# EAGLE design taptdoa_1.x (EAGLE 9.2.2)
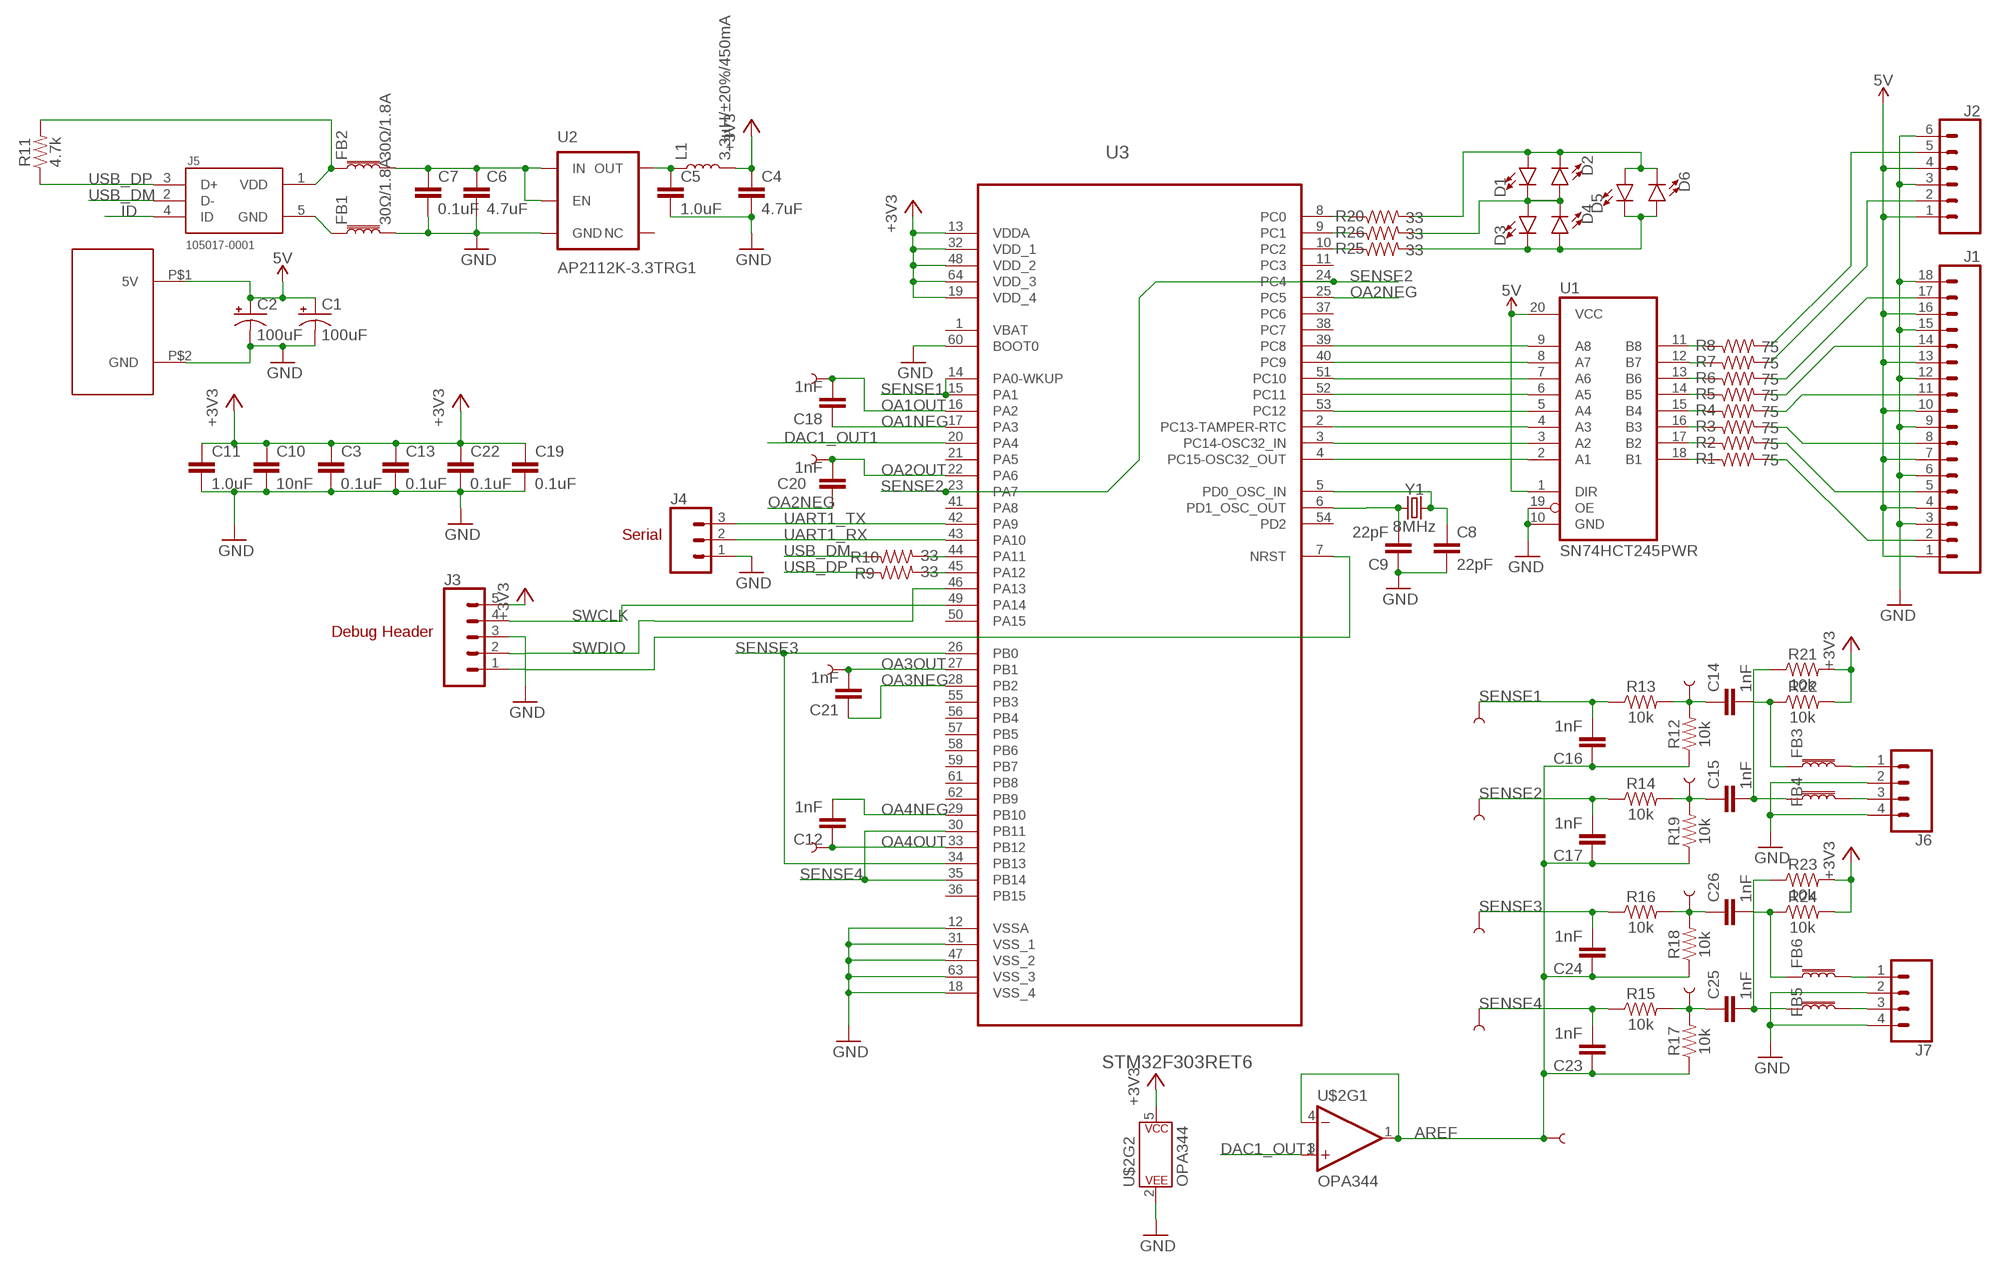
[diagram p0: schematic, sheet 1]

## Parts
C1  100uF  100UF-POLAR-25V-20%(ELEC)  [PANASONIC_D]
C2  100uF  100UF-POLAR-25V-20%(ELEC)  [PANASONIC_D]
C3  0.1uF  0.1UF-0603-25V-5%  [0603]
C4  4.7uF  4.7UF0603  [0603]
C5  1.0uF  1.0UF-0603-16V-10%  [0603]
C6  4.7uF  1.0UF-0603-16V-10%  [0603]
C7  0.1uF  0.1UF-0603-25V-5%  [0603]
C8  22pF  22PF-0603-50V-5%  [0603]
C9  22pF  22PF-0603-50V-5%  [0603]
C10  10nF  10NF-0603-50V-10%  [0603]
C11  1.0uF  1.0UF-0603-16V-10%  [0603]
C12  1nF  1.0UF-0603-16V-10%  [0603]
C13  0.1uF  0.1UF-0603-25V-5%  [0603]
C14  1nF  1.0UF-0603-16V-10%  [0603]
C15  1nF  1.0UF-0603-16V-10%  [0603]
C16  1nF  1.0UF-0603-16V-10%  [0603]
C17  1nF  1.0UF-0603-16V-10%  [0603]
C18  1nF  1.0UF-0603-16V-10%  [0603]
C19  0.1uF  0.1UF-0603-25V-5%  [0603]
C20  1nF  1.0UF-0603-16V-10%  [0603]
C21  1nF  1.0UF-0603-16V-10%  [0603]
C22  0.1uF  0.1UF-0603-25V-5%  [0603]
C23  1nF  1.0UF-0603-16V-10%  [0603]
C24  1nF  1.0UF-0603-16V-10%  [0603]
C25  1nF  1.0UF-0603-16V-10%  [0603]
C26  1nF  1.0UF-0603-16V-10%  [0603]
D1  LED0603  [LED-0603]
D2  LED0603  [LED-0603]
D3  LED0603  [LED-0603]
D4  LED0603  [LED-0603]
D5  LED0603  [LED-0603]
D6  LED0603  [LED-0603]
FB1  30Ω/1.8A  FERRITE_BEAD-0603  [0603]
FB2  30Ω/1.8A  FERRITE_BEAD-0603  [0603]
FB3  30Ω/1.8A  FERRITE_BEAD-0603  [0603]
FB4  30Ω/1.8A  FERRITE_BEAD-0603  [0603]
FB5  30Ω/1.8A  FERRITE_BEAD-0603  [0603]
FB6  30Ω/1.8A  FERRITE_BEAD-0603  [0603]
J1  CONN_18  [1X18]
J2  CONN_06LOCK  [1X06_LOCK]
J3  CONN_05LOCK  [1X05_LOCK]
J4  CONN_03  [1X03]
J5  105017-0001  [MOLEX_105017-0001]
J6  CONN_04LOCK_LONGPADS  [1X04_LOCK_LONGPADS]
J7  CONN_04LOCK_LONGPADS  [1X04_LOCK_LONGPADS]
L1  3.3µH/±20%/450mA  INDUCTOR-0805-3.3UH  [0805]
R1  75  100OHM-0603-1/4W-5%  [0603]
R2  75  100OHM-0603-1/4W-5%  [0603]
R3  75  100OHM-0603-1/4W-5%  [0603]
R4  75  100OHM-0603-1/4W-5%  [0603]
R5  75  100OHM-0603-1/4W-5%  [0603]
R6  75  100OHM-0603-1/4W-5%  [0603]
R7  75  100OHM-0603-1/4W-5%  [0603]
R8  75  100OHM-0603-1/4W-5%  [0603]
R9  33  100OHM-0603-1/4W-5%  [0603]
R10  33  100OHM-0603-1/4W-5%  [0603]
R11  4.7k  RESISTOR0603  [0603]
R12  10k  RESISTOR0603  [0603]
R13  10k  RESISTOR0603  [0603]
R14  10k  RESISTOR0603  [0603]
R15  10k  RESISTOR0603  [0603]
R16  10k  RESISTOR0603  [0603]
R17  10k  RESISTOR0603  [0603]
R18  10k  RESISTOR0603  [0603]
R19  10k  RESISTOR0603  [0603]
R20  33  100OHM-0603-1/4W-5%  [0603]
R21  10k  RESISTOR0603  [0603]
R22  10k  RESISTOR0603  [0603]
R23  10k  RESISTOR0603  [0603]
R24  10k  RESISTOR0603  [0603]
R25  33  100OHM-0603-1/4W-5%  [0603]
R26  33  100OHM-0603-1/4W-5%  [0603]
TP1  TEST-POINT3X4  [PAD.03X.04]
TP2  TEST-POINT3X4  [PAD.03X.04]
TP3  TEST-POINT3X4  [PAD.03X.04]
TP4  TEST-POINT3X4  [PAD.03X.04]
TP5  TEST-POINT3X4  [PAD.03X.04]
TP6  TEST-POINT3X4  [PAD.03X.04]
TP7  TEST-POINT3X4  [PAD.03X.04]
TP8  TEST-POINT3X4  [PAD.03X.04]
TP9  TEST-POINT3X4  [PAD.03X.04]
TP10  TEST-POINT3X4  [PAD.03X.04]
TP11  TEST-POINT3X4  [PAD.03X.04]
TP12  TEST-POINT3X4  [PAD.03X.04]
TP13  TEST-POINT3X4  [PAD.03X.04]
U1  SN74HCT245PWR  74245PW  [TSSOP20]
U2  AP2112K-3.3TRG1  V_REG_AP2112K-3.3V  [SOT23-5]
U3  STM32F303RET6  STM32F103RBT6  [QFP50P1200X1200X160-64N]
U$1  XT30XT30_THRUHOLE  [ZT30]
U$2  OPA344  [SOT23-5]
Y1  8MHz  CRYSTALSMD-HC49UP  [HC49UP]

## Nets
5V: C1.+ C2.+ J1.1 J1.4 J1.7 J1.10 J1.13 J1.16 J2.1 J2.4 U1.1(DIR) U1.20(VCC) U$1.P$1(5V)
+3V3: C3.1 C4.1 C10.1 C11.1 C13.1 C19.1 C22.1 J3.5 L1.2 R21.2 R22.2 R23.2 R24.2 U3.13(VDDA) U3.19(VDD_4) U3.32(VDD_1) U3.48(VDD_2) U3.64(VDD_3) U$2.5(P$V+)
AREF: C16.1 C17.1 C23.1 C24.1 R12.1 R17.1 R18.1 R19.1 TP8.P$1 U$2.1(OUT) U$2.4(-IN)
DAC1_OUT1: U3.20(PA4) U$2.3(+IN)
GND: C1.- C2.- C3.2 C4.2 C5.2 C6.2 C7.2 C8.2 C9.1 C10.2 C11.2 C13.2 C19.2 C22.2 FB1.2 J1.3 J1.6 J1.9 J1.12 J1.15 J1.18 J2.3 J2.6 J3.3 J4.1 J6.2 J6.4 J7.2 J7.4 U1.10(GND) U1.19(OE) U2.2(GND) U3.12(VSSA) U3.18(VSS_4) U3.31(VSS_1) U3.47(VSS_2) U3.60(BOOT0) U3.63(VSS_3) U$1.P$2(GND) U$2.2(P$V-)
HP1: C14.1 R12.2 R13.2 TP2.P$1
HP2: C15.1 R14.2 R19.2 TP3.P$1
HP3: C26.1 R16.2 R18.2 TP12.P$1
HP4: C25.1 R15.2 R17.2 TP13.P$1
ID: J5.4(ID)
LED0: J1.2 R1.2
LED1: J1.5 R2.2
LED2: J1.8 R3.2
LED3: J1.11 R4.2
LED4: J1.14 R5.2
LED5: J1.17 R6.2
N$1: R20.1 U3.8(PC0)
N$2: D1.A D2.C D5.A D6.C R20.2
N$4: R25.1 U3.10(PC2)
N$5: R26.1 U3.9(PC1)
N$6: D1.C D2.A D3.A D4.C R26.2
N$9: R10.1 U3.44(PA11)
N$10: R9.1 U3.45(PA12)
N$11: FB1.1 J5.5(GND)
N$12: C5.1 L1.1 U2.5(OUT)
N$13: R1.1 U1.18(B1)
N$14: R2.1 U1.17(B2)
N$15: R3.1 U1.16(B3)
N$16: R4.1 U1.15(B4)
N$17: R5.1 U1.14(B5)
N$18: R6.1 U1.13(B6)
N$19: C14.2 FB3.1 R22.1
N$20: C26.2 FB6.1 R24.1
N$21: C15.2 FB4.1 R21.1
N$22: D3.C D4.A D5.C D6.A R25.2
N$23: C25.2 FB5.1 R23.1
N$27: R7.1 U1.12(B7)
N$28: R8.1 U1.11(B8)
N$29: J2.2 R7.2
N$30: J2.5 R8.2
N$31: FB3.2 J6.1
N$32: FB6.2 J7.1
N$33: FB5.2 J7.3
N$34: FB4.2 J6.3
NRST: J3.1 U3.7(NRST)
OA1NEG: C18.1 U3.17(PA3)
OA1OUT: C18.2 TP6.P$1 U3.16(PA2)
OA2NEG: C20.1 U3.25(PC5)
OA2OUT: C20.2 TP7.P$1 U3.22(PA6)
OA3NEG: C21.1 U3.28(PB2)
OA3OUT: C21.2 TP9.P$1 U3.27(PB1)
OA4NEG: C12.2 U3.29(PB10)
OA4OUT: C12.1 TP1.P$1 U3.33(PB12)
PA13: J3.2 U3.46(PA13)
PA14: J3.4 U3.49(PA14)
PC8: U1.9(A8) U3.39(PC8)
PC9: U1.8(A7) U3.40(PC9)
PC10: U1.7(A6) U3.51(PC10)
PC11: U1.6(A5) U3.52(PC11)
PC12: U1.5(A4) U3.53(PC12)
PC13: U1.4(A3) U3.2(PC13-TAMPER-RTC)
PC14: U1.3(A2) U3.3(PC14-OSC32_IN)
PC15: U1.2(A1) U3.4(PC15-OSC32_OUT)
PD0_OSC_IN: C8.1 U3.5(PD0_OSC_IN) Y1.2
PD1_OSC_OUT: C9.2 U3.6(PD1_OSC_OUT) Y1.1
SENSE1: C16.2 R13.1 TP4.P$1 U3.14(PA0-WKUP) U3.15(PA1)
SENSE2: C17.2 R14.1 TP5.P$1 U3.23(PA7) U3.24(PC4)
SENSE3: C24.2 R16.1 TP10.P$1 U3.26(PB0) U3.34(PB13)
SENSE4: C23.2 R15.1 TP11.P$1 U3.30(PB11) U3.35(PB14)
UART1_RX: J4.2 U3.43(PA10)
UART1_TX: J4.3 U3.42(PA9)
USB_DM: J5.2(D-) R10.2
USB_DP: J5.3(D+) R9.2 R11.1
VUSB: FB2.1 J5.1(VDD) R11.2
VUSB2: C6.1 C7.1 FB2.2 U2.1(IN) U2.3(EN)
Unconnected: U2.4(NC) U3.1(VBAT) U3.11(PC3) U3.21(PA5) U3.36(PB15) U3.37(PC6) U3.38(PC7) U3.41(PA8) U3.50(PA15) U3.54(PD2) U3.55(PB3) U3.56(PB4) U3.57(PB5) U3.58(PB6) U3.59(PB7) U3.61(PB8) U3.62(PB9)

## Notes on the sheet
- Serial
- SWCLK
- Debug Header
- SWDIO

## Library data of the parts
C1 C2 = SparkFun-Capacitors:100UF-POLAR: 100µF polarized capacitors A capacitor is a passive two-terminal electrical component used to store electrical energy temporarily in an electric field.; PROD_ID: CAP-12547
C3 C7 C13 C19 C22 = SparkFun-Capacitors:0.1UF: 0.1µF ceramic capacitors A capacitor is a passive two-terminal electrical component used to store electrical energy temporarily in an electric field.; PROD_ID: CAP-08604
C4 = SparkFun-Capacitors:4.7UF: 4.7µF ceramic capacitors A capacitor is a passive two-terminal electrical component used to store electrical energy temporarily in an electric field.; PROD_ID: CAP-08280
C5 C11 = SparkFun-Capacitors:1.0UF: 1µF ceramic capacitors A capacitor is a passive two-terminal electrical component used to store electrical energy temporarily in an electric field.; PROD_ID: CAP-00868
C6 C12 C14-C18 C20 C21 C23-C26 = SparkFun-Capacitors:1.0UF: 1µF ceramic capacitors A capacitor is a passive two-terminal electrical component used to store electrical energy temporarily in an electric field.; PROD_ID: CAP-00868; VALUE: 1.0uF
C8 C9 = SparkFun-Capacitors:22PF: 22pF ceramic capacitors A capacitor is a passive two-terminal electrical component used to store electrical energy temporarily in an electric field.; PROD_ID: CAP-07876
C10 = SparkFun-Capacitors:10NF: 0.01uF/10nF/10,000pF ceramic capacitors A capacitor is a passive two-terminal electrical component used to store electrical energy temporarily in an electric field. CAP-09321; PROD_ID: CAP-00867
D1-D6 = SparkFun-LED:LED: LED (Generic) Standard schematic elements and footprints for 5mm, 3mm, 1206, and 0603 sized LEDs. Generic LEDs with no color specified.
FB1-FB6 = SparkFun-Coils:FERRITE_BEAD: Ferrite Bead (blocks, cores, rings, chokes, etc.) Inductor with layers of ferrite used to suppress high frequencies. Often used to isolate high frequency noise. SparkFun Products: IOIO-OTG - V2.2 <https://www.sparkfun.com/products/13613> SparkFun SAMD21 Mini Breakout <https://www.sparkfun.com/products/13664> SparkFun 6 Degrees of Freedom Breakout - LSM6DS3 <https://www.sparkfun.com/products/13339> SparkFun SAMD21 Dev Breakout <https://www.sparkfun.com/products/13672>; PROD_ID: NDUC-07859
J1 = SparkFun-Connectors:CONN_18: Multi connection point. Often used as Generic Header-pin footprint for 0.1 inch spaced/style header connections On any of the 0.1 inch spaced packages, you can populate with these: Break Away Headers - Straight <https://www.sparkfun.com/products/116> (PRT-00116) Break Away Male Headers - Right Angle <https://www.sparkfun.com/products/553> (PRT-00553) Female Headers <https://www.sparkfun.com/products/115> (PRT-00115) Break Away Headers - Machine Pin <https://www.sparkfun.com/products/117> (PRT-00117) Break Away Female Headers - Swiss Machine Pin <https://www.sparkfun.com/products/743> (PRT-00743) For SCREWTERMINALS and SPRING TERMINALS visit here: Screw Terimnals on SparkFun.com <https://www.sparkfun.com/search/results?term=Screw+Terminals> (5mm/3.5mm/2.54mm spacing) This device is also useful as a general connection point to wire up your design to another part of your project. Our various solder wires solder well into these plated through hole pads. Hook-Up Wire - Assortment (Stranded, 22 AWG) <https://www.sparkfun.com/products/11375> (PRT-11375) Hook-Up Wire - Assortment (Solid Core, 22 AWG) <https://www.sparkfun.com/products/11367> (PRT-11367) View the entire wire category on our website here <https://www.sparkfun.com/categories/141> Special notes: Molex polarized connector foot print use with SKU : PRT-08231 with associated crimp pins and housings. 1MM SMD Version SKU: PRT-10208 NOTES ON THE VARIANTS LOCK and LOCK_LONGPADS... This footprint was designed to help hold the alignment of a through-hole component (i.e. 6-pin header) while soldering it into place. You may notice that each hole has been shifted either up or down by 0.005 of an inch from it's more standard position (which is a perfectly straight line). This slight alteration caused the pins (the squares in the middle) to touch the edges of the holes. Because they are alternating, it causes a "brace" to hold the component in place. 0.005 has proven to be the perfect amount of "off-center" position when using our standard breakaway headers. Although looks a little odd when you look at the bare footprint, once you have a header in there, the alteration is very hard to notice. Also,if you push a header all the way into place, it is covered up entirely on the bottom side.
J2 = SparkFun-Connectors:CONN_06: Multi connection point. Often used as Generic Header-pin footprint for 0.1 inch spaced/style header connections On any of the 0.1 inch spaced packages, you can populate with these: Break Away Headers - Straight <https://www.sparkfun.com/products/116> (PRT-00116) Break Away Male Headers - Right Angle <https://www.sparkfun.com/products/553> (PRT-00553) Female Headers <https://www.sparkfun.com/products/115> (PRT-00115) Break Away Headers - Machine Pin <https://www.sparkfun.com/products/117> (PRT-00117) Break Away Female Headers - Swiss Machine Pin <https://www.sparkfun.com/products/743> (PRT-00743) Arduino Stackable Header - 6 Pin <https://www.sparkfun.com/products/9280> (PRT-09280) For SCREWTERMINALS and SPRING TERMINALS visit here: Screw Terimnals on SparkFun.com <https://www.sparkfun.com/search/results?term=Screw+Terminals> (5mm/3.5mm/2.54mm spacing) This device is also useful as a general connection point to wire up your design to another part of your project. Our various solder wires solder well into these plated through hole pads. Hook-Up Wire - Assortment (Stranded, 22 AWG) <https://www.sparkfun.com/products/11375> (PRT-11375) Hook-Up Wire - Assortment (Solid Core, 22 AWG) <https://www.sparkfun.com/products/11367> (PRT-11367) View the entire wire category on our website here <https://www.sparkfun.com/categories/141>
J3 = SparkFun-Connectors:CONN_05: Multi connection point. Often used as Generic Header-pin footprint for 0.1 inch spaced/style header connections On any of the 0.1 inch spaced packages, you can populate with these: Break Away Headers - Straight <https://www.sparkfun.com/products/116> (PRT-00116) Break Away Male Headers - Right Angle <https://www.sparkfun.com/products/553> (PRT-00553) Female Headers <https://www.sparkfun.com/products/115> (PRT-00115) Break Away Headers - Machine Pin <https://www.sparkfun.com/products/117> (PRT-00117) Break Away Female Headers - Swiss Machine Pin <https://www.sparkfun.com/products/743> (PRT-00743) For SCREWTERMINALS and SPRING TERMINALS visit here: Screw Terimnals on SparkFun.com <https://www.sparkfun.com/search/results?term=Screw+Terminals> (5mm/3.5mm/2.54mm spacing) This device is also useful as a general connection point to wire up your design to another part of your project. Our various solder wires solder well into these plated through hole pads. Hook-Up Wire - Assortment (Stranded, 22 AWG) <https://www.sparkfun.com/products/11375> (PRT-11375) Hook-Up Wire - Assortment (Solid Core, 22 AWG) <https://www.sparkfun.com/products/11367> (PRT-11367) View the entire wire category on our website here <https://www.sparkfun.com/categories/141> Special notes: Molex polarized connector foot print use with SKU : PRT-08231 with associated crimp pins and housings. 1MM SMD Version SKU: PRT-10208
J4 = SparkFun-Connectors:CONN_03: Multi connection point. Often used as Generic Header-pin footprint for 0.1 inch spaced/style header connections On any of the 0.1 inch spaced packages, you can populate with these: Break Away Headers - Straight <https://www.sparkfun.com/products/116> (PRT-00116) Break Away Male Headers - Right Angle <https://www.sparkfun.com/products/553> (PRT-00553) Female Headers <https://www.sparkfun.com/products/115> (PRT-00115) Break Away Headers - Machine Pin <https://www.sparkfun.com/products/117> (PRT-00117) Break Away Female Headers - Swiss Machine Pin <https://www.sparkfun.com/products/743> (PRT-00743) Stackable Header - 3 Pin (Female, 0.1") <https://www.sparkfun.com/products/13875> (PRT-13875) For SCREWTERMINALS and SPRING TERMINALS visit here: Screw Terimnals on SparkFun.com <https://www.sparkfun.com/search/results?term=Screw+Terminals> (5mm/3.5mm/2.54mm spacing) This device is also useful as a general connection point to wire up your design to another part of your project. Our various solder wires solder well into these plated through hole pads. Hook-Up Wire - Assortment (Stranded, 22 AWG) <https://www.sparkfun.com/products/11375> (PRT-11375) Hook-Up Wire - Assortment (Solid Core, 22 AWG) <https://www.sparkfun.com/products/11367> (PRT-11367) View the entire wire category on our website here <https://www.sparkfun.com/categories/141> Special notes: Molex polarized connector foot print use with SKU : PRT-08232 with associated crimp pins and housings.
J5 = molex usb 105017-0001:105017-0001; AVAILABILITY: Good; DESCRIPTION: Conn USB Type B M 5 POS 0.65mm Solder RA Thru-Hole 5 Terminal 1 Port Embossed T/R; MF: Molex; MP: 105017-0001; PACKAGE: None; PRICE: 0.51 USD
J6 J7 = SparkFun-Connectors:CONN_04: Multi connection point. Often used as Generic Header-pin footprint for 0.1 inch spaced/style header connections On any of the 0.1 inch spaced packages, you can populate with these: Break Away Headers - Straight <https://www.sparkfun.com/products/116> (PRT-00116) Break Away Male Headers - Right Angle <https://www.sparkfun.com/products/553> (PRT-00553) Female Headers <https://www.sparkfun.com/products/115> (PRT-00115) Break Away Headers - Machine Pin <https://www.sparkfun.com/products/117> (PRT-00117) Break Away Female Headers - Swiss Machine Pin <https://www.sparkfun.com/products/743> (PRT-00743) For SCREWTERMINALS and SPRING TERMINALS visit here: Screw Terimnals on SparkFun.com <https://www.sparkfun.com/search/results?term=Screw+Terminals> (5mm/3.5mm/2.54mm spacing) This device is also useful as a general connection point to wire up your design to another part of your project. Our various solder wires solder well into these plated through hole pads. Hook-Up Wire - Assortment (Stranded, 22 AWG) <https://www.sparkfun.com/products/11375> (PRT-11375) Hook-Up Wire - Assortment (Solid Core, 22 AWG) <https://www.sparkfun.com/products/11367> (PRT-11367) View the entire wire category on our website here <https://www.sparkfun.com/categories/141> Special notes: Molex polarized connector foot print use with SKU : PRT-08231 with associated crimp pins and housings. 1MM SMD Version SKU: PRT-10208; PROD_ID: CONN-09696
L1 = SparkFun-Coils:INDUCTOR: Inductors Resist changes in electrical current. Basically a coil of wire. SparkFun Products: SparkFun Load Cell Amplifier - HX711 <https://www.sparkfun.com/products/13879> IOIO-OTG - V2.2 <https://www.sparkfun.com/products/13613>; PROD_ID: NDUC-13076
R1-R10 R20 R25 R26 = SparkFun-Resistors:100OHM: 100Ω resistor A resistor is a passive two-terminal electrical component that implements electrical resistance as a circuit element. Resistors act to reduce current flow, and, at the same time, act to lower voltage levels within circuits. - Wikipedia; PROD_ID: RES-12438; VALUE: 100
R11-R19 R21-R24 = SparkFun-Resistors:RESISTOR: Generic Resistor Package
TP1-TP13 = SparkFun-Connectors:TEST-POINT: SparkFun Test Points Bare copper test points for troubleshooting or In-Circuit-Testing. These are used by our Production team for verifying production board runs using pogo-pins on test beds. SparkFun Products: SparkFun LSM9DS1 Breakout <https://www.sparkfun.com/products/13284> SparkFun PSOC <https://www.sparkfun.com/products/13714> SparkFun Load Cell Amplifier <https://www.sparkfun.com/products/13879>
U1 = scanlime:74*245: Octal BUS TRANSCEIVER, 3-state
U2 = SparkFun-PowerIC:V_REG_AP2112: AP2112 - 600mA CMOS LDO Regulator w/ Enable The AP2112 is CMOS process low dropout linear regulator with enable function, the regulator delivers a guaranteed 600mA (min.) continuous load current. Features Output Voltage Accuracy: ±1.5% Output Current: 600mA (Min.) Foldback Short Current Protection: 50mA Enable Function to Turn ON/OFF VOUT Low Dropout Voltage (3.3V): 250mV (Typ.) @IOUT=600mA Excellent Load Regulation: 0.2%/A (Typ.) Excellent Line Regulation: 0.02%/V (Typ.) Low Quiescent Current: 55μA (Typ.) Low Standby Current: 0.01μA (Typ.) Low Output Noise: 50μVRMS PSRR: 100Hz -65dB, 1kHz -65dB OTSD Protection Stable with 1.0μF Flexible Cap: Ceramic, Tantalum and Aluminum Electrolytic Operation Temperature Range: -40°C to 85°C ESD: MM 400V, HBM 4000V; PROD_ID: VREG-12457; VALUE: 3.3V
U3 = ST Microelctronics_By_element14_Batch_1:STM32F103RBT6: 32BIT MCU; MPN: STM32F103RBT6; OC_FARNELL: 1447640; OC_NEWARK: 59M2183; PACKAGE: LQFP-64; SUPPLIER: STMICROELECTRONICS
U$1 = XT30Male:XT30: XT30 thru hole from TME Part # XT30PW-M
U$2 = SparkFun-IC-Amplifiers:OPA344: Single gate rail-to-rail output op-amp. Inputs extend 300mV past rails. Datasheet <http://www.ti.com/product/OPA344> SparkFun Products SparkFun Low Current Sensor <https://www.sparkfun.com/products/8883> (SEN-08883) SparkFun Electret Microphone Breakout <https://www.sparkfun.com/products/12758> (BOB-12758); PROD_ID: IC-08251
Y1 = SparkFun-Clocks:CRYSTAL: Crystals (Generic) These are passive quartz crystals, which can be used as a clock source for a microcontroller. Crystal's are two-terminal devices. They require external "load" capacitors to generate an oscillating signal.

## Board
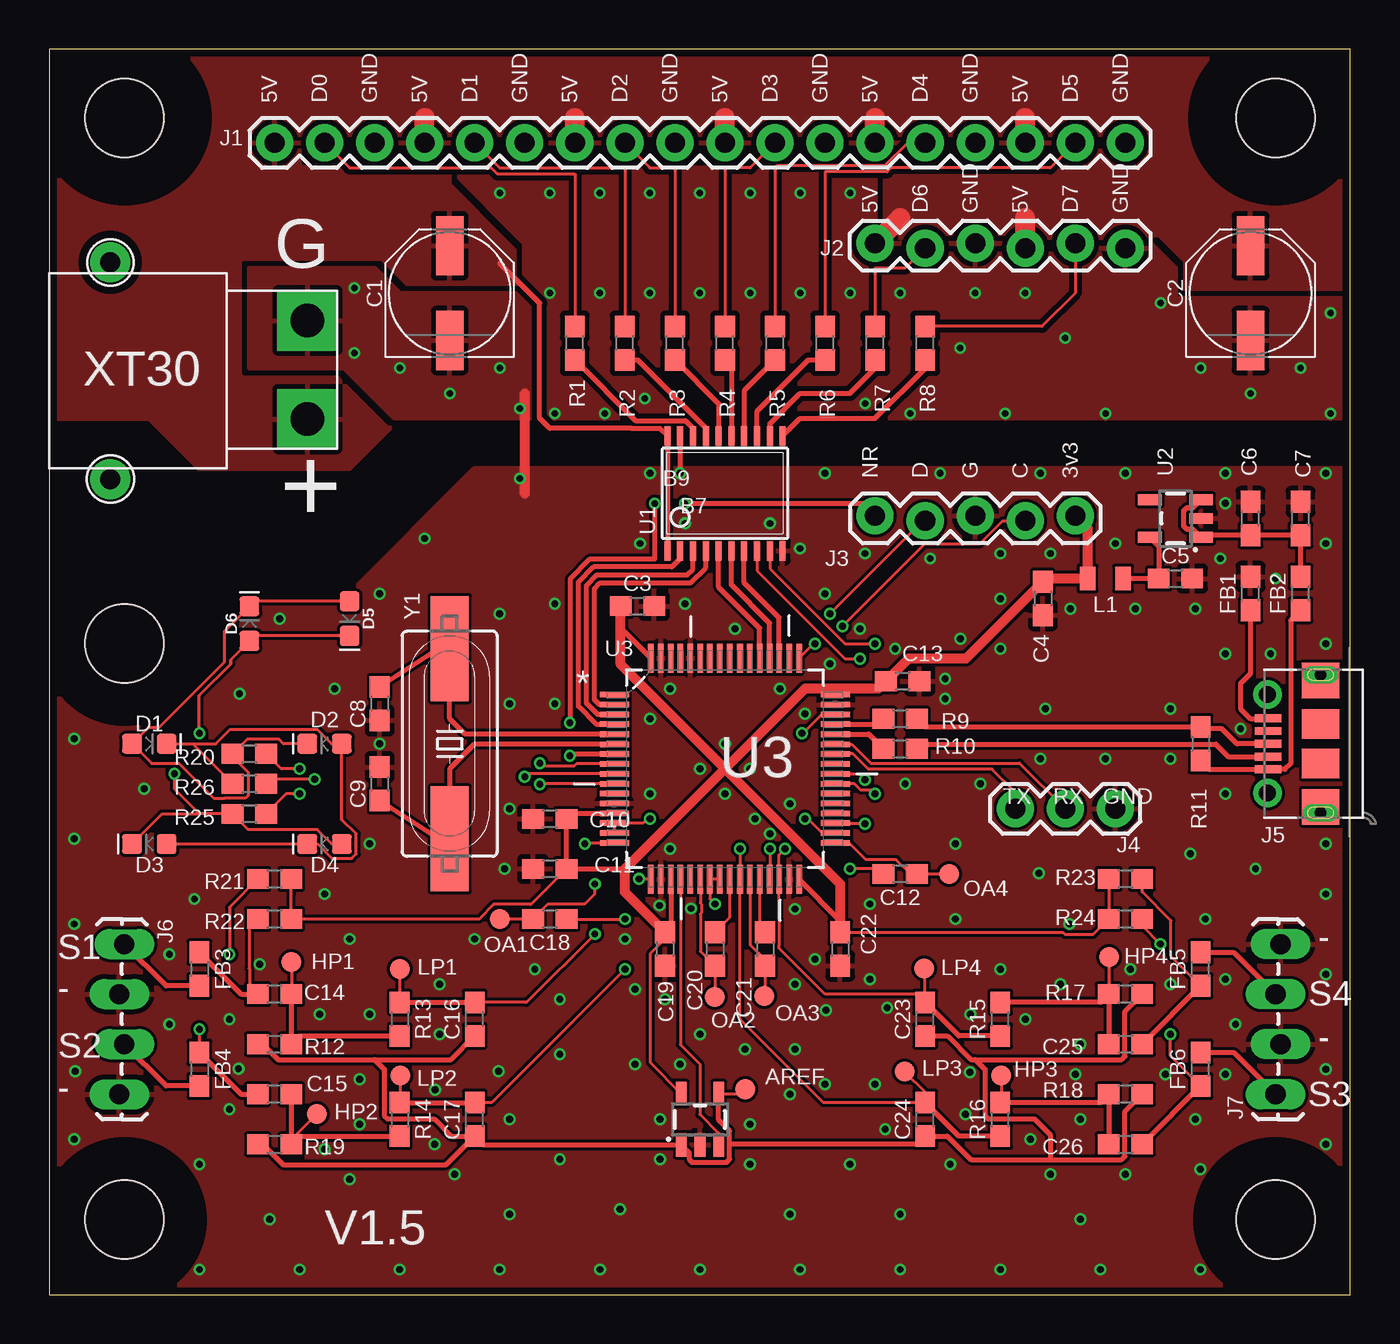
[diagram p1: board, top side]
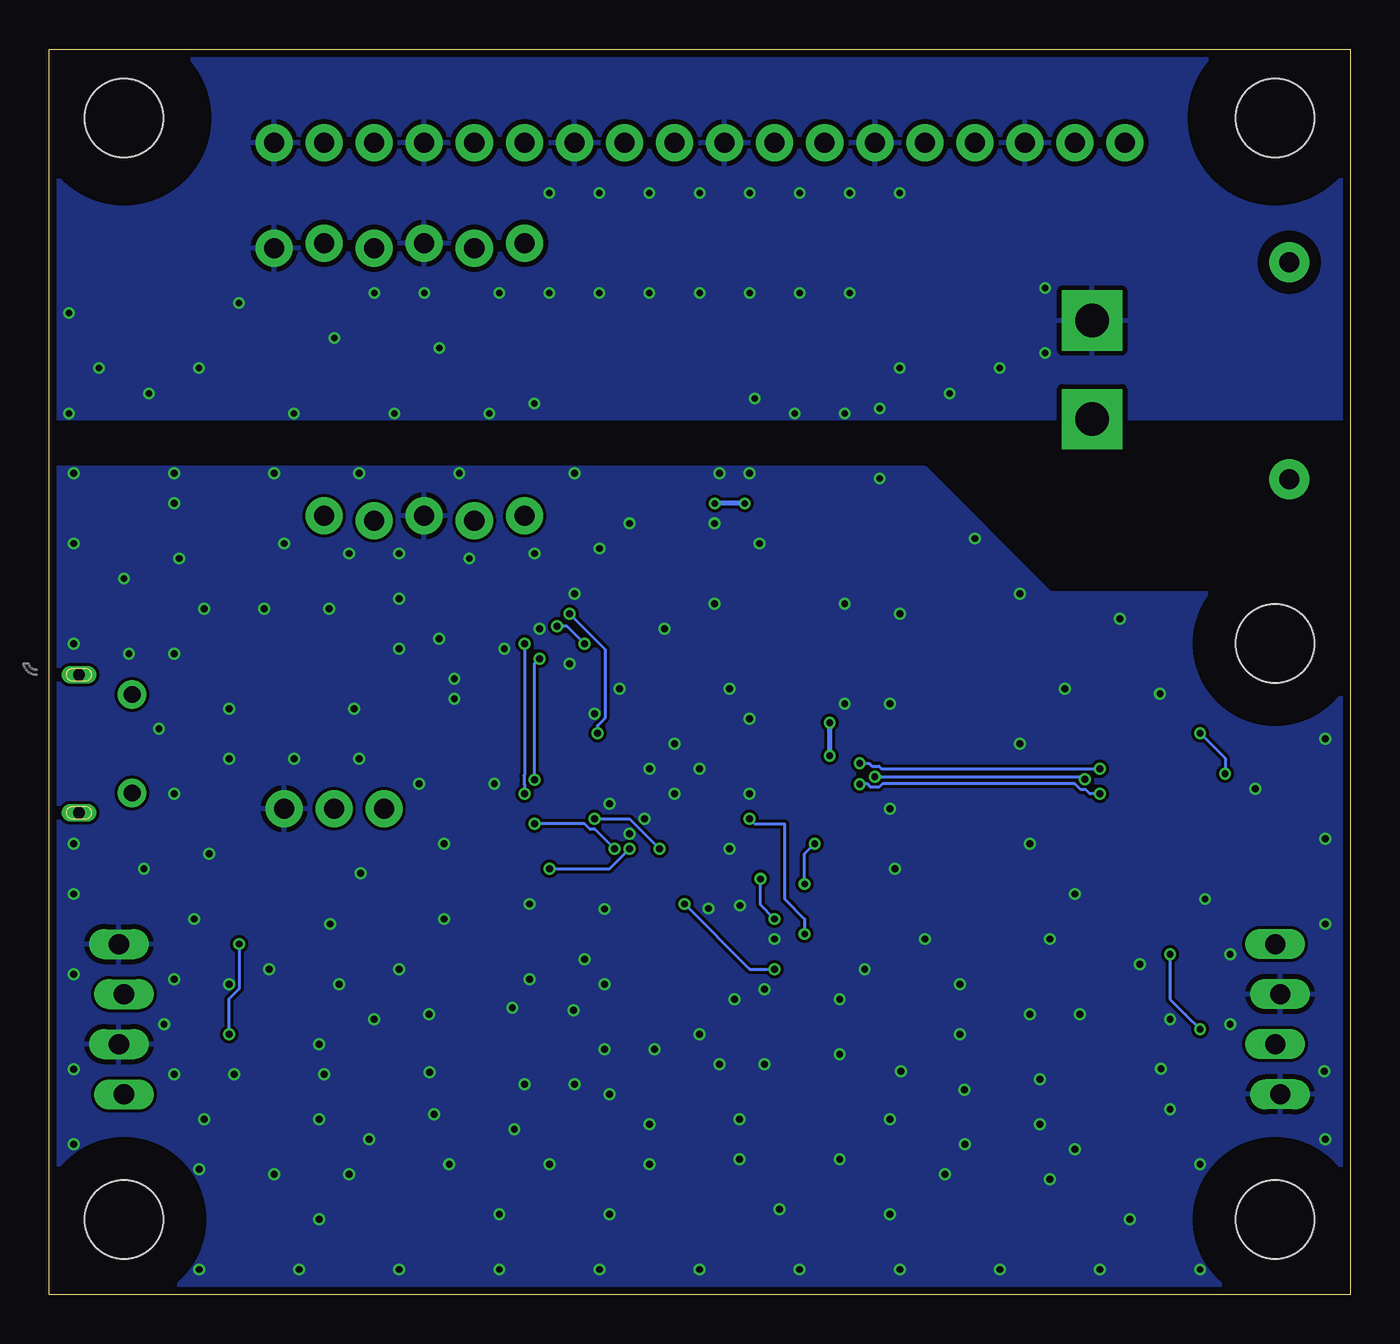
[diagram p2: board, bottom side, seen from below]

Size 66.02 x 63.17 mm. Coordinates in mm from the lower left corner, seen from the top.
Outline: 0,0 66.02,0 66.02,63.17 0,63.17 0,0
Copper layers (1*16): Top 0.035559375mm / dielectric 1.6mm / Bottom 0.035559375mm
Design rules "oshpark-2layer": minimum track width 6mil, minimum drill 10mil, track to track 6mil, track to pad 6mil, pad to pad 6mil, via to via 6mil, smd to smd 6mil, copper to edge 15mil, drill to drill 6mil, minimum pad ring 5mil, minimum via ring 5mil, stop-mask expansion 2.5mil, vias tented up to drill 0mil, thermal gap 10mil
Holes 3.99 mm at 3.81,33.02 62.23,59.69 3.81,59.69 3.81,3.81 62.23,3.81
tRestrict: area -0.2,55.7 to 7.8,63.7; area 58.2,55.7 to 66.2,63.7; area -0.2,29 to 7.8,37; area -0.2,-0.2 to 7.8,7.8; area 58.2,-0.2 to 66.2,7.8; area 1.9,51.2 to 4.3,53.6; area 1.9,40.1 to 4.3,42.6
bRestrict: area -0.2,55.7 to 7.8,63.7; area 58.2,55.7 to 66.2,63.7; area -0.2,29 to 7.8,37; area -0.2,-0.2 to 7.8,7.8; area 58.2,-0.2 to 66.2,7.8; area 1.9,51.2 to 4.3,53.6; area 1.9,40.1 to 4.3,42.6

### Footprints (pad centres in the part's own frame; a part is rotated, then mirrored left to right if it is on the bottom)
PANASONIC_D = smd 3 x 1.4: + 2.4,0; - -2.4,0
0603 = smd 1.1 x 1: 1 -0.85,0; 2 0.85,0
LED-0603 = smd 1 x 1: A -0.877,0; C 0.877,0
1X18 = drill 1.016 pad 1.88: 1 0,0; 2 2.54,0; 3 5.08,0; 4 7.62,0; 5 10.16,0; 6 12.7,0; 7 15.24,0; 8 17.78,0; 9 20.32,0; 10 22.86,0; 11 25.4,0; 12 27.94,0; 13 30.48,0; 14 33.02,0; 15 35.56,0; 16 38.1,0; 17 40.64,0; 18 43.18,0
1X06_LOCK = drill 1.016 pad 1.88: 1 0,0; 2 2.54,-0.254; 3 5.08,0; 4 7.62,-0.254; 5 10.16,0; 6 12.7,-0.254
1X05_LOCK = drill 1.016 pad 1.88: 1 0,0.127; 2 2.54,-0.127; 3 5.08,0.127; 4 7.62,-0.127; 5 10.16,0.127
1X03 = drill 1.016 pad 1.88: 1 0,0; 2 2.54,0; 3 5.08,0
MOLEX_105017-0001 = smd 0.4 x 1.35: 1 -1.3,2.675; 2 -0.65,2.675; 3 0,2.675; 4 0.65,2.675; 5 1.3,2.675 | drill 0.85 pad 1.45: P$1 -2.5,2.7; P$2 2.5,2.7 | smd 1.5 x 1.9: P$8 -1,0; P$9 1,0 | smd 1.8 x 1.9: P$10 -3.2,0; P$11 3.2,0 | drill 0.6 pad 0.8 long: P$12 -3.5,0; P$13 3.5,0
1X04_LOCK_LONGPADS = drill 1.016 long: 1 0,0; 2 2.54,-0.254; 3 5.08,0; 4 7.62,-0.254
0805 = smd 0.8 x 1.2: 1 -0.9,0; 2 0.9,0
PAD.03X.04 = smd 1.016 x 1.016: P$1 0,0
TSSOP20 = smd 0.305 x 0.991: 1 -2.925,-2.918; 2 -2.275,-2.918; 3 -1.625,-2.918; 4 -0.975,-2.918; 5 -0.325,-2.918; 6 0.325,-2.918; 7 0.975,-2.918; 8 1.625,-2.918; 9 2.275,-2.918; 10 2.925,-2.918; 11 2.925,2.918; 12 2.275,2.918; 13 1.625,2.918; 14 0.975,2.918; 15 0.325,2.918; 16 -0.325,2.918; 17 -0.975,2.918; 18 -1.625,2.918; 19 -2.275,2.918; 20 -2.925,2.918
SOT23-5 = smd 0.55 x 1.2: 1 -0.95,-1.3; 2 0,-1.3; 3 0.95,-1.3; 4 0.95,1.3; 5 -0.95,1.3
QFP50P1200X1200X160-64N = smd 1.473 x 0.279: 1 -5.613,3.759; 2 -5.613,3.251; 3 -5.613,2.743; 4 -5.613,2.261; 5 -5.613,1.753; 6 -5.613,1.245; 7 -5.613,0.762; 8 -5.613,0.254; 9 -5.613,-0.254; 10 -5.613,-0.762; 11 -5.613,-1.245; 12 -5.613,-1.753; 13 -5.613,-2.261; 14 -5.613,-2.743; 15 -5.613,-3.251; 16 -5.613,-3.759; 33 5.613,-3.759; 34 5.613,-3.251; 35 5.613,-2.743; 36 5.613,-2.261; 37 5.613,-1.753; 38 5.613,-1.245; 39 5.613,-0.762; 40 5.613,-0.254; 41 5.613,0.254; 42 5.613,0.762; 43 5.613,1.245; 44 5.613,1.753; 45 5.613,2.261; 46 5.613,2.743; 47 5.613,3.251; 48 5.613,3.759 | smd 0.279 x 1.473: 17 -3.759,-5.613; 18 -3.251,-5.613; 19 -2.743,-5.613; 20 -2.261,-5.613; 21 -1.753,-5.613; 22 -1.245,-5.613; 23 -0.762,-5.613; 24 -0.254,-5.613; 25 0.254,-5.613; 26 0.762,-5.613; 27 1.245,-5.613; 28 1.753,-5.613; 29 2.261,-5.613; 30 2.743,-5.613; 31 3.251,-5.613; 32 3.759,-5.613; 49 3.759,5.613; 50 3.251,5.613; 51 2.743,5.613; 52 2.261,5.613; 53 1.753,5.613; 54 1.245,5.613; 55 0.762,5.613; 56 0.254,5.613; 57 -0.254,5.613; 58 -0.762,5.613; 59 -1.245,5.613; 60 -1.753,5.613; 61 -2.261,5.613; 62 -2.743,5.613; 63 -3.251,5.613; 64 -3.759,5.613
ZT30 = drill 1.7 pad 3.048 square: P$1 13.1,2.5; P$2 13.1,7.5 | drill 1.016 pad 2.032: P$3 3.099,10.452; P$4 3.099,-0.546
HC49UP = smd 5.334 x 1.93: 1 -4.826,0; 2 4.826,0

### Placement (x,y rotation side)
C1  20.32,50.8 90 top
C2  60.96,50.8 90 top
C3  29.84,34.92 0 top
C4  50.42,35.31 270 top
C5  57.15,36.32 0 top
C6  60.96,39.37 90 top
C7  63.5,39.37 90 top
C8  16.76,29.97 270 top
C9  16.76,25.91 270 top
C10  25.4,24.13 180 top
C11  25.4,21.59 180 top
C12  43.18,21.34 180 top
C13  43.31,31.11 0 top
C14  11.43,15.24 180 top
C15  11.43,10.16 180 top
C16  21.59,13.97 90 top
C17  21.59,8.89 90 top
C18  25.4,19.05 180 top
C19  31.24,17.53 270 top
C20  33.78,17.53 270 top
C21  36.32,17.53 270 top
C22  40.13,17.53 270 top
C23  44.45,13.97 90 top
C24  44.45,8.89 90 top
C25  54.61,12.7 0 top
C26  54.61,7.62 0 top
D1  5.08,27.94 0 top
D2  13.97,27.94 180 top
D3  5.08,22.86 180 top
D4  13.97,22.86 180 top
D5  15.24,34.29 270 top
D6  10.16,34.04 90 top
FB1  60.96,35.56 90 top
FB2  63.5,35.56 90 top
FB3  7.62,16.51 270 top
FB4  7.62,11.43 270 top
FB5  58.42,16.51 90 top
FB6  58.42,11.43 90 top
J1  11.43,58.42 0 top
J2  41.91,53.34 0 top
J3  41.91,39.37 0 top
J4  54.1,24.64 180 top
J5  64.52,27.94 90 top
J6  3.81,17.78 270 top
J7  62.23,10.16 90 top
L1  53.59,36.32 180 top
R1  26.67,48.26 90 top
R2  29.21,48.26 90 top
R3  31.75,48.26 90 top
R4  34.29,48.26 90 top
R5  36.83,48.26 90 top
R6  39.37,48.26 90 top
R7  41.91,48.26 90 top
R8  44.45,48.26 90 top
R9  43.18,29.21 0 top
R10  43.18,27.69 0 top
R11  58.42,27.94 270 top
R12  11.43,12.7 0 top
R13  17.78,13.97 270 top
R14  17.78,8.89 270 top
R15  48.26,13.97 90 top
R16  48.26,8.89 90 top
R17  54.61,15.24 180 top
R18  54.61,10.16 180 top
R19  11.43,7.62 0 top
R20  10.16,27.43 180 top
R21  11.43,21.08 0 top
R22  11.43,19.05 0 top
R23  54.61,21.08 180 top
R24  54.61,19.05 180 top
R25  10.16,24.38 180 top
R26  10.16,25.91 180 top
TP1  45.67,21.34 0 top
TP2  12.29,16.87 0 top
TP3  13.59,9.17 0 top
TP4  17.78,16.51 0 top
TP5  17.81,11.1 0 top
TP6  22.86,19.05 0 top
TP7  33.78,15.09 0 top
TP8  35.31,10.41 0 top
TP9  36.27,15.14 0 top
TP10  43.41,11.3 0 top
TP11  44.4,16.54 0 top
TP12  48.31,11.1 0 top
TP13  53.77,17.12 0 top
U1  34.29,40.64 0 top
U2  57.15,39.37 90 top
U3  34.29,26.67 0 top
U$1  0,41.91 0 top
U$2  33.02,8.89 0 top
Y1  20.32,27.94 90 top

### Tracks (layer width: path | path; a pad name or v marks a point on that pad's centre or on a via)
5V
  Top 0.254: 22.86,52.32 24.89,50.29 24.89,44.45 25.4,43.94 29.56,43.94 29.58,43.93 31,43.93 U1.20 U1.1
  Top 1.016: 49.53,53.34 49.53,54.61 | J1.4 19.05,59.69 | J1.7 26.67,59.69 | J1.10 34.29,59.69 | J1.13 41.91,59.69 | J1.16 49.53,59.69 | J2.1 43.18,54.61
  pour Top (isolate 0.254, rank 6): 0,44.45 5.08,44.45 7.62,41.91 15.24,41.91 24.13,50.8 24.13,53.34 20.32,57.15 12.7,57.15 12.7,58.42 41.91,58.42 41.91,53.34 55.88,53.34 55.88,50.8 67.31,50.55 67.31,64.77 0,64.77
+3V3
  Top 0.152: C19.1 31.24,18.05 30.51,17.32 30.51,11.75 U$2.5 | R21.2 12.28,20.32 R22.2 21.82,19.05 22.55,19.79 24.45,19.79 25.19,20.53 C11.1 | R23.2 R24.2 52.98,18.27 51.55,18.27 51.44,18.38 C22.1
  Top 0.254: 29.21,21.59 C11.1 C10.1 26.53,24.41 U3.13 | U3.32 40.13,18.97 C22.1 | U3.19 31.55,18.68 C19.1 | U3.48 39.88,30.45 39.88,30.73 | U3.64 29,33.82 C3.1
  Top 0.508: 34.04,26.42 29.21,21.59 29.21,20.41 C19.1 | 34.04,26.42 34.29,26.67 | 34.29,26.67 40.13,20.83 C22.1 | 34.04,26.42 38.35,30.73 39.88,30.73 42.08,30.73 C13.1 43.6,32.26 46.52,32.26 C4.1 50.59,36.32 L1.2 52.69,38.87 J3.5 | 34.29,26.67 29,31.96 C3.1
AREF
  Top 0.152: U$2.4 35.08,10.19 TP8.P$1
  Top 0.254: R12.1 10.84,12.7 11.61,11.92 16.51,11.92 | 16.51,11.92 20.39,11.92 C16.1 | R19.1 10.84,7.62 11.87,6.59 20.14,6.59 C17.1 | C17.1 20.39,8.04 19.52,8.91 17.16,8.91 17,9.07 17,11.43 16.51,11.92 | C17.1 22.04,7.59 U$2.1 32.47,7.19 32.47,6.87 32.63,6.71 34.36,6.71 34.52,6.87 34.52,7.62 | 34.52,7.62 34.52,8.31 33.97,8.86 U$2.4 | 34.52,7.62 44.03,7.62 C24.1 45.58,8.04 46.77,6.84 50.8,6.84 | R18.1 54.59,9.29 54.59,7 54.43,6.84 50.8,6.84 | C23.1 45.58,13.12 46.77,11.92 46.99,11.92 | R17.1 54.59,14.37 54.59,12.08 54.43,11.92 46.99,11.92 | 50.8,6.84 50.8,8.11 50,8.91 47.64,8.91 47.48,9.07 47.48,11.43 46.99,11.92
DAC1_OUT1
  Top 0.152: U3.20 32.03,12.68 33.02,11.68 33.02,9.14 33.97,8.19 U$2.3
GND  (via drill 0.33, 0.35)
  Top 0.254: U1.19 32.02,41.41
  Top 0.508: 24.13,45.72 24.13,40.64
  other vias: 49.53,50.8 46.99,50.8 58.42,46.99 60.96,45.72 63.5,46.99 38.1,50.8 35.56,50.8 33.02,50.8 30.48,50.8 27.94,50.8 25.4,50.8 40.64,50.8 43.18,50.8 38.1,55.88 35.56,55.88 33.02,55.88 30.48,55.88 27.94,55.88 25.4,55.88 40.64,55.88 22.86,55.88 28.19,44.7 30.23,45.47 41.4,45.21 43.69,44.7 46.23,48.01 51.56,48.51 56.39,50.29 48.51,44.7 53.59,44.7 65.02,44.7 65.02,49.78 23.88,41.4 31.24,14.99 29.21,18.03 23.11,21.59 23.37,24.64 23.37,29.97 22.86,34.54 25.65,35.05 29.97,38.1 36.58,39.12 19.05,38.35 16.76,35.56 11.68,34.29 16.26,22.86 1.27,28.19 1.27,23.11 1.27,18.8 1.32,11.33 1.27,7.87 7.62,6.6 7.62,1.27 12.7,1.27 17.78,1.27 22.86,1.27 27.94,1.27 33.02,1.27 38.1,1.27 43.18,1.27 48.26,1.27 53.34,1.27 58.42,1.27 58.42,6.35 64.77,7.62 64.77,11.43 64.77,16.26 64.77,20.32 64.77,22.86 57.91,22.35 59.69,25.4 56.9,27.18 53.59,27.18 50.29,27.18 47.24,25.91 43.43,25.91 45.47,30.23 50.55,29.72 56.9,29.72 60.45,28.7 61.98,32.51 64.77,33.02 64.77,38.1 64.77,41.66 59.69,41.66 54.61,41.66 50.29,41.66 45.21,41.66 39.37,41.66 30.48,41.66 4.83,25.65 9.65,30.48 16.76,27.94 13.97,20.32 21.59,18.03 15.24,18.03 10.67,16.76 6.1,17.27 9.14,13.97 6.1,13.72 9.6,11.46 15.75,10.92 13.72,14.22 16.26,14.22 19.81,13.21 19.58,10.39 22.81,11.33 25.91,14.99 23.37,8.89 15.75,8.64 15.24,5.84 9.14,9.4 20.57,6.1 25.91,6.86 30.99,6.86 30.99,8.89 29.72,11.68 29.72,15.49 25.91,12.19 19.81,15.75 24.64,16.51 31.5,22.61 30.96,19.74 34.29,25.4 35.56,26.67 34.29,27.94 33.02,26.67 30.48,29.21 30.48,25.4 36.58,23.37 35.81,24.13 37.59,24.89 38.35,29.46 39.62,32 37.08,30.73 31.5,30.73 37.85,19.56 38.86,17.02 50.22,21.36 46.74,14.22 49.53,13.97 52.32,12.7 51.31,15.75 48.26,16.51 56.9,15.75 52.07,11.18 52.32,8.89 49.78,7.87 46.48,9.14 46.71,11.28 41.91,10.67 42.52,14.55 37.85,15.75 39.42,14.43 37.85,12.45 32.56,19.58 33.02,13.21 35.56,8.64 42.42,8.38 37.59,10.16 35.31,12.45 35.56,6.6 40.64,6.6 45.72,6.6 50.8,6.1 54.61,6.1 58.17,8.89 59.69,11.18 56.64,11.18 60.2,13.72 59.69,16 19.56,7.62 13.97,7.37 32,11.68 39.37,10.67 41.66,19.81 41.66,16 45.97,19.05 45.97,22.86 51.77,18.8 54.86,16.51 61.21,21.59 58.67,19.05 48.26,32.77 45.47,31.24 51.82,34.8 58.17,34.8 55.12,34.8 54.1,38.1 59.69,40.13 62.23,36.32 59.69,32.51 59.44,37.34 52.32,3.81 43.18,4.06 37.59,4.06 28.96,4.32 23.37,4.06 11.18,3.81 48.26,37.59 44.7,37.34 41.15,33.78 42.93,32.77 46.23,33.27 48.26,35.31 50.8,37.59 22.86,46.99 17.78,46.99 20.32,45.72 23.88,44.96 15.49,51.05 15.49,47.75 14.48,30.73 32.26,39.12 32,41.66 39.37,35.56 38.1,37.85 41.4,37.59 7.37,20.07 32.26,35.05 34.8,33.78 25.65,44.7 25.65,29.97
  pour Top: -2.54,35.56 15.24,35.56 21.59,41.91 67.31,41.91 67.31,-2.54 -2.54,-2.54
  pour Bottom (rank 6): -2.54,35.56 15.24,35.56 21.59,41.91 67.31,41.91 67.31,-2.54 -2.54,-2.54
  pour Bottom (isolate 0.254): -1.27,44.45 17.78,44.45 68.58,44.45 68.58,64.77 -1.27,64.77
  pour Top (isolate 0.254): 57.15,50.55 67.31,50.55 67.31,44.45 24.13,44.45 24.13,53.34 20.32,57.15 41.91,57.15 41.91,53.34 55.88,53.34 57.15,52.07
  pour Top (isolate 0.254): 10.16,52.07 16.51,52.07 17.78,50.8 24.13,50.8 24.13,44.45 17.53,44.45 14.99,46.99 10.16,46.99
HP1
  Top 0.152: TP2.P$1 12.29,15.25 C14.1
  Top 0.254: C14.1 R12.2 12.7,13.12 R13.2
HP2
  Top 0.152: TP3.P$1 12.28,7.86 R19.2
  Top 0.254: C15.1 R19.2 12.7,8.04 R14.2
HP3
  Top 0.152: TP12.P$1 48.31,9.79 R16.2
  Top 0.254: C26.1 R18.2 53.34,9.74 R16.2
HP4
  Top 0.152: TP13.P$1 53.77,15.25 R17.2
  Top 0.254: C25.1 R17.2 53.34,14.82 R15.2
LED0
  Top 0.152: J1.2 15.24,57.15 22.43,57.15 22.73,56.84 26.67,56.84 R1.2
LED1
  Top 0.152: J1.5 22.86,57.15 27.94,57.15 29.21,57.15 R2.2
LED2
  Top 0.152: J1.8 30.48,57.15 31.75,57.15 R3.2
LED3
  Top 0.152: J1.11 35.56,57.15 34.29,57.15 R4.2
LED4
  Top 0.152: J1.14 43.56,58.42 42.39,57.25 36.93,57.25 36.83,57.15 R5.2
LED5
  Top 0.152: J1.17 50.8,57.15 42.72,57.15 42.52,56.95 39.37,56.95 R6.2
N$1  (via drill 0.35)
  Top 0.152: U3.8 26.76,26.92 26.64,26.8 25.04,26.8 v24.89,26.95 | v12.7,26.67 11.77,26.67 R20.1
  Bottom 0.152: v24.89,26.95 24.41,26.95 24.26,26.8 23.91,26.8 23.78,26.67 v12.7,26.67
N$2
  Top 0.152: D2.C 11.88,27.94 11.65,28.16 10.04,28.16 R20.2 9.31,27.28 10.09,26.5 10.09,25.31 | 10.09,25.31 9.96,25.18 | D5.A 10.41,35.17 | 10.41,35.17 D6.C | 10.09,25.31 9.96,25.18 | 9.96,25.18 8.89,25.18 8.34,25.18 6.57,26.95 5.2,26.95 D1.A 5.04,28.77 5.57,28.77 8.89,32.1 8.89,33.64 10.41,35.17
N$4  (via drill 0.35)
  Top 0.152: U3.10 24.91,25.91 v24.89,25.89 | v12.7,25.4 12.03,25.4 R25.1
  Bottom 0.152: v12.7,25.4 13.21,25.4 13.42,25.61 13.68,25.61 13.97,25.9 23.75,25.9 23.91,25.74 24.35,25.74 24.51,25.9 24.88,25.9 v24.89,25.89
N$5  (via drill 0.35)
  Top 0.152: U3.9 24.27,26.42 v24.13,26.27 | v13.46,26.14 11.24,26.14 R26.1
  Bottom 0.152: v24.13,26.27 13.6,26.27 v13.46,26.14
N$6
  Top 0.152: D3.A D4.C 13.61,22.86 14.34,22.13 15.35,22.13 15.58,22.35 15.58,23.37 14.85,24.09 D2.A 14.33,27.94 13.6,28.67 9.17,28.67 8.45,27.94 D1.C 7.28,27.94 R26.2
N$9
  Top 0.254: U3.44 41.59,28.42 R10.1
N$10
  Top 0.254: U3.45 42.05,28.93 R9.1
N$11
  Top 0.254: FB1.1 60.96,31.5 60.45,30.99 60.45,29.72 60.96,29.21 61.81,29.21 J5.5
N$12
  Top 0.254: U2.5 56.3,37.97 C5.1 L1.1
N$13
  Top 0.254: R1.1 29.75,44.33 32.28,44.33 32.66,43.95 U1.18
N$14
  Top 0.254: R2.1 29.86,47.41 33.31,43.95 U1.17
N$15
  Top 0.254: R3.1 33.97,45.2 U1.16
N$16
  Top 0.254: R4.1 34.62,47.09 U1.15
N$17
  Top 0.254: R5.1 35.27,45.84 U1.14
N$18
  Top 0.254: U1.13 35.91,44.8 38.52,47.41 R6.1
N$19
  Top 0.152: 10.16,15.24 10.16,16.52 10.14,16.54 10.14,18.61 R22.1
  Top 0.254: FB3.1 9.74,15.24 10.16,15.24 C14.2
N$20  (via drill 0.35)
  Top 0.152: FB6.1 56.9,12.1 v56.9,13.21 | v56.39,17.78 55.46,18.71 R24.1
  Top 0.254: FB6.1 C26.2
  Bottom 0.152: v56.9,13.21 56.9,15 56.37,15.53 56.37,17.76 v56.39,17.78
N$21  (via drill 0.35)
  Top 0.152: R21.1 9.14,19.65 v9.14,17.27 | v7.62,13.46 FB4.1
  Top 0.254: FB4.1 9.74,10.16 C15.2
  Bottom 0.152: v9.14,17.27 9.14,14.99 8.36,14.2 v7.62,13.46
N$22  (via drill 0.35)
  Top 0.152: 7.62,24.38 R25.2 10.11,23.59 13.6,23.59 14.33,22.86 D4.A | v6.35,26.42 6.35,25.65 7.62,24.38 | D3.C 5.73,24.38 7.62,24.38 | v7.62,28.47 7.62,30.4 9.2,31.97 | 9.2,32.19 9.2,31.97 | D5.C 10.41,33.41 D6.A 9.2,32.19 | 9.2,31.97 9.2,32.19
  Bottom 0.152: v7.62,28.47 6.35,27.2 v6.35,26.42
N$23
  Top 0.152: FB5.1 56.92,17.16 56.92,18.96 55.46,20.42 R23.1
  Top 0.254: FB5.1 C25.2
N$27
  Top 0.254: U1.12 36.56,44.19 38.1,45.72 40.64,45.72 41.91,46.99 R7.1
N$28
  Top 0.254: U1.11 38.11,44.45 41.91,44.45 44.45,46.99 R8.1
N$29
  Top 0.152: J2.2 43.43,52.07 41.91,52.07 R7.2
N$30
  Top 0.152: J2.5 52.07,50.8 50.38,49.11 R8.2
N$31
  Top 0.254: FB3.2 5.93,15.66 J6.1
N$32
  Top 0.254: FB6.2 60.11,12.28 J7.1
N$33
  Top 0.254: FB5.2 60.11,17.36 J7.3
N$34
  Top 0.254: FB4.2 5.93,10.58 J6.3
NRST  (via drill 0.33, 0.35)
  Top 0.254: v26.42,29 26.44,29.03 26.44,36.3 27.45,37.32 30.73,37.32 v30.73,40.13 | v26.42,27.33 26.52,27.43 U3.7 | v32.26,40.13 41.27,40.13 J3.1
  Bottom 0.254: v26.42,29 v26.42,27.33 | v30.73,40.13 v32.26,40.13
OA1NEG  (via drill 0.35)
  Top 0.152: C18.1 v29.21,19.05 | v29.92,21.08 30.5,21.08 U3.17
  Bottom 0.152: v29.21,19.05 29.92,19.76 v29.92,21.08
OA1OUT  (via drill 0.35)
  Top 0.152: v27.18,22.86 27.23,22.91 U3.16 | v27.69,20.83 27.69,20.32 27.18,19.81 25.31,19.81 C18.2 TP6.P$1
  Bottom 0.152: v27.69,20.83 27.69,22.35 v27.18,22.86
OA2NEG
  Top 0.152: C20.1 34.54,19.14 U3.25
OA2OUT
  Top 0.152: U3.22 33.05,19.85 33.09,19.8 33.09,19.36 33.05,19.32 33.05,17.41 C20.2 TP7.P$1
OA3NEG
  Top 0.152: U3.28 36.04,18.66 C21.1
OA3OUT
  Top 0.152: U3.27 35.59,21 35.59,17.73 36.32,17 C21.2 36.32,15.19 TP9.P$1
OA4NEG  (via drill 0.35)
  Top 0.152: 42.08,21.59 41.91,21.59 | 41.91,21.59 v40.64,21.59 | v36.58,22.61 36.58,21.08 U3.29 | C12.2 42.08,21.59 | 42.08,21.59 41.91,21.59
  Bottom 0.152: v40.64,21.59 37.59,21.59 v36.58,22.61
OA4OUT
  Top 0.152: U3.33 40.59,22.91 41.44,22.07 42.98,22.07 43.7,21.34 C12.1 TP1.P$1
PA13  (via drill 0.35)
  Top 0.152: v39.62,34.54 44.32,39.24 J3.2 | U3.46 39.17,29.4 38.25,28.47 v38.2,28.47
  Bottom 0.152: v38.2,28.47 38.2,28.87 37.82,29.24 37.82,32.74 v39.62,34.54
PA14  (via drill 0.35)
  Top 0.152: U3.49 38.79,33.02 v38.86,33.02 | v40.25,33.9 44.42,38.08 47.22,38.08 48.39,39.24 J3.4
  Bottom 0.152: v38.86,33.02 39.74,33.9 v40.25,33.9
PC8  (via drill 0.35)
  Top 0.152: U1.9 36.58,37.71 36.58,36.83 40.39,33.02 v41.91,33.02 | v41.91,25.4 41.72,25.59 41.18,25.59 40.87,25.91 U3.39
  Bottom 0.152: v41.91,33.02 41.91,26.36 41.93,26.34 41.93,25.9 41.91,25.88 v41.91,25.4
PC9  (via drill 0.35)
  Top 0.152: U3.40 41.11,26.42 v41.4,26.12 | U1.8 35.91,36.73 40.39,32.26 v41.15,32.26
  Bottom 0.152: v41.4,26.12 41.4,32 v41.15,32.26
PC10
  Top 0.254: U3.51 37.03,34.34 35.27,36.11 U1.7
PC11
  Top 0.254: U3.52 36.55,34.06 34.62,36 U1.6
PC12
  Top 0.254: U3.53 36.04,33.81 33.97,35.88 U1.5
PC13
  Top 0.254: U1.4 33.31,36.87 32.54,36.1 27.96,36.1 27.66,35.8 27.66,30.17 27.91,29.92 U3.2
PC14
  Top 0.254: U1.3 32.66,36.8 32.37,36.5 27.79,36.5 27.25,35.97 27.25,30 27.85,29.41 U3.3
PC15
  Top 0.254: U1.2 32.02,37.33 31.59,36.91 27.62,36.91 26.85,36.13 26.85,29.84 27.75,28.93 U3.4
PD0_OSC_IN
  Top 0.254: U3.5 21.11,28.42 20.32,29.21 20.32,30.48 Y1.2 19.77,32.77 C8.1
PD1_OSC_OUT
  Top 0.254: U3.6 21.57,27.91 20.32,26.67 20.32,24.64 20.32,24.13 Y1.1 19.77,23.11 C9.2
SENSE1  (via drill 0.35)
  Top 0.152: U3.15 U3.14 30.16,23.93 30.36,24.13 v30.48,24.13 | v27.69,18.29 24.22,14.82 C16.2 | TP4.P$1 R13.1
  Top 0.254: R13.1 C16.2
  Bottom 0.152: v27.69,18.29 27.69,19.05 28.7,20.07 28.7,23.88 30.23,23.88 v30.48,24.13
SENSE2  (via drill 0.35)
  Top 0.152: U3.24 U3.23 33.53,20.07 v33.78,19.81 | v29.21,16.51 22.44,9.74 C17.2 | TP5.P$1 17.8,9.77 R14.1
  Top 0.254: R14.1 C17.2
  Bottom 0.152: v33.78,19.81 30.48,16.51 v29.21,16.51
SENSE3  (via drill 0.35)
  Top 0.152: v38.35,24.13 38.5,24.13 39.21,23.42 U3.34 | v35.05,22.61 35.05,21.59 | 35.05,21.59 U3.26 | 35.05,21.59 35.05,13.97 39.28,9.74 C24.2 44.45,10.26 TP10.P$1
  Top 0.254: R16.1 46.15,8.04 C24.2
  Bottom 0.152: v38.35,24.13 36.58,24.13 v35.05,22.61
SENSE4  (via drill 0.35)
  Top 0.152: v37.34,22.61 37.03,22.3 U3.30 37.03,19.04 37.05,19.02 37.05,17.73 37.03,17.71 37.03,17.58 39.37,15.24 44.03,15.24 C23.2 44.4,14.87 TP11.P$1 | v41.4,23.88 39.95,23.88 U3.35
  Top 0.254: R15.1 46.15,13.12 C23.2
  Bottom 0.152: v37.34,22.61 38.33,23.6 38.57,23.6 38.85,23.88 v41.4,23.88
UART1_RX
  Top 0.152: U3.43 40.73,27.91 41.69,26.96 49.24,26.96 J4.2
UART1_TX
  Top 0.152: J4.3 49.02,25.48 47.85,26.65 41.56,26.65 40.78,27.43 U3.42
USB_DM
  Top 0.254: J5.2 59.83,27.29 59.2,27.92 44.09,27.92 44.03,27.86 R10.2
USB_DP
  Top 0.254: J5.3 60.27,27.94 59.5,28.7 58.51,28.7 R11.1 44.45,28.79 R9.2
VUSB
  Top 0.254: FB2.1 62.99,34.2 62.99,26.92 62.71,26.64 J5.1 58.87,26.64 R11.2
VUSB2
  Top 0.254: FB2.2 C7.1 C6.1 58.55,38.52 U2.1 58.05,38.82 57.73,38.82 57.57,38.98 57.57,39.76 57.73,39.92 58.05,39.92 U2.3

### Text on the board
tNames: 5V | D0 | GND | 5V | D1 | GND | 5V | D2 | GND | 5V | D3 | GND | 5V | D4 | GND | 5V | D5 | GND | 5V | D6 | GND | 5V | D7 | GND | B9 | NR | D | G | C | 3v3 | B7 | TX | RX | GND | OA4 | - | S1 | HP1 | OA1 | HP4 | LP1 | LP4 | - | S4 | OA2 | OA3 | S2 | - | LP2 | AREF | LP3 | HP3 | - | S3 | HP2 | V1.5